# EAGLE design untitled (EAGLE 6.1)
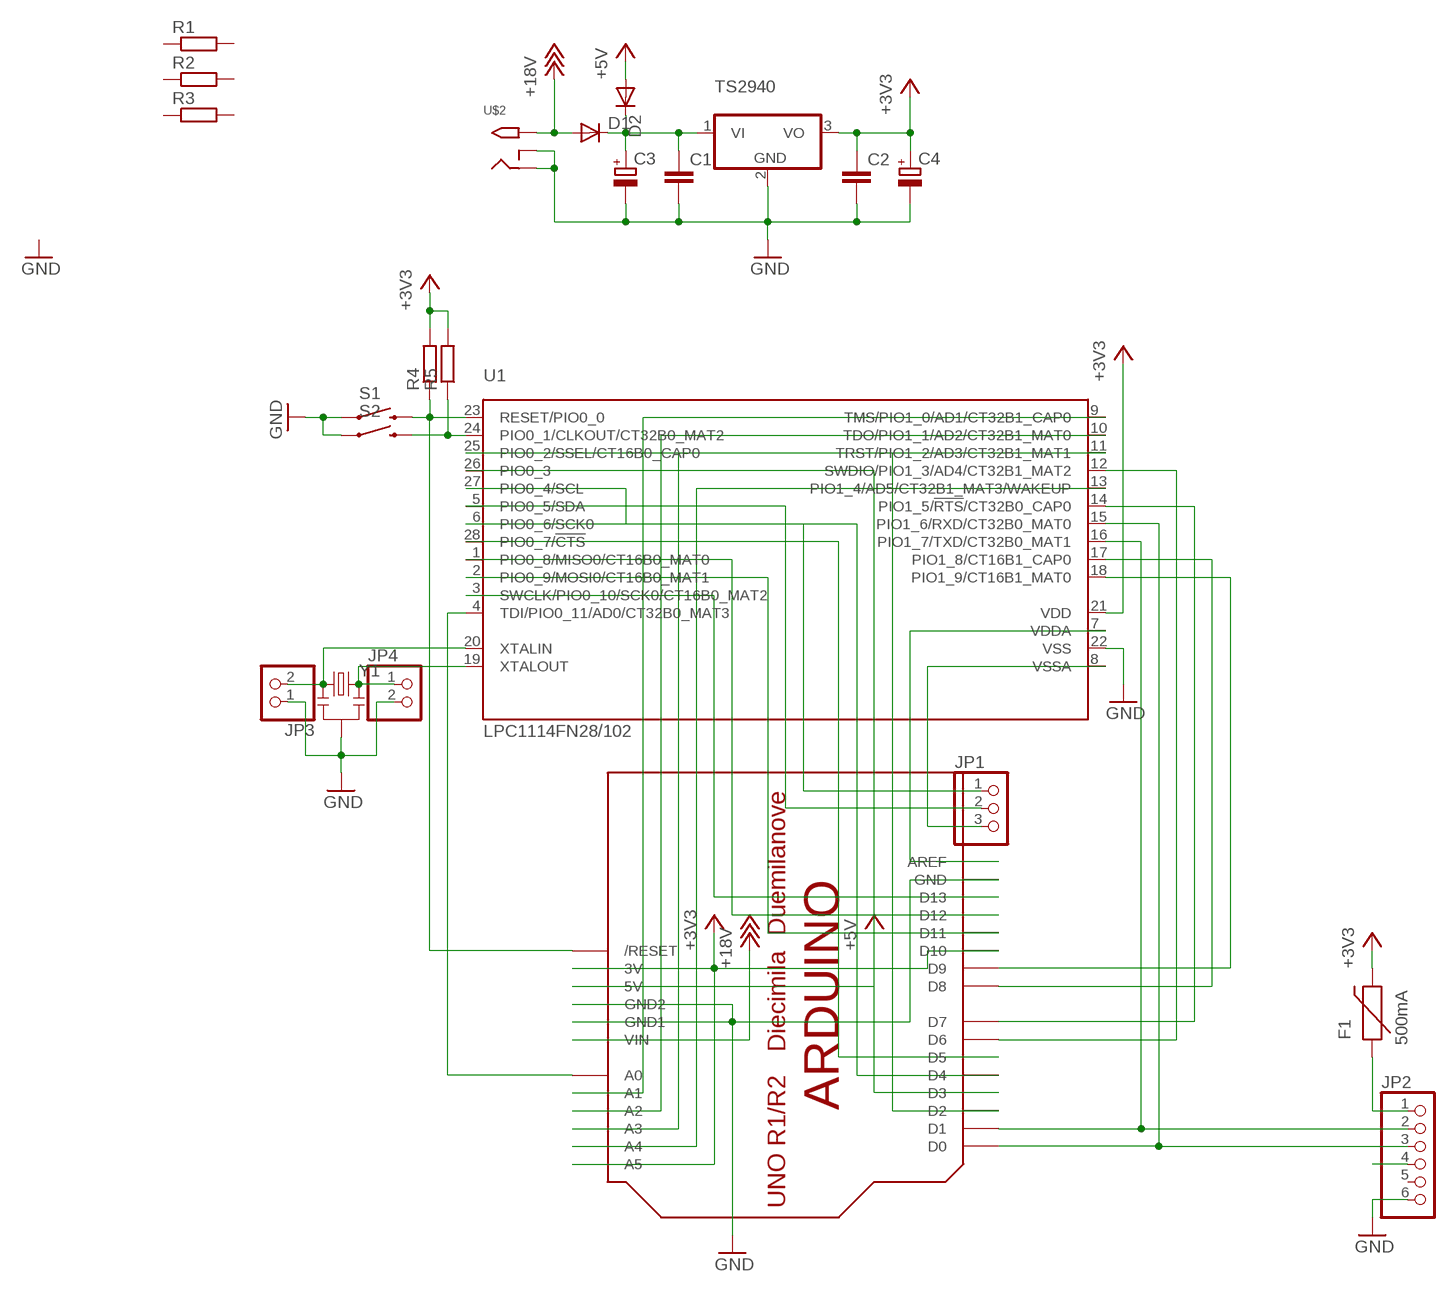
[diagram p0: schematic, sheet 1]

## Parts
C1  C-EU025-025X050  [C025-025X050]
C2  C-EU025-025X050  [C025-025X050]
C3  CPOL-EUE2.5-6  [E2,5-6]
C4  CPOL-EUE2.5-6  [E2,5-6]
D1  DIODE-C1702-05  [C1702-05]
D2  DIODE-C1702-05  [C1702-05]
F1  500mA  PTCPTH  [PTC]
JP1  PINHD-1X3  [1X03]
JP2  PINHD-1X6/90  [1X06/90]
JP3  PINHD-1X2  [1X02]
JP4  PINHD-1X2  [1X02]
R1  R-EU_0204/7  [0204/7]
R2  R-EU_0204/7  [0204/7]
R3  R-EU_0204/7  [0204/7]
R4  R-EU_0204/7  [0204/7]
R5  R-EU_0204/7  [0204/7]
S1  SWITCH-MOMENTARY-2PTH  [TACTILE-PTH]
S2  SWITCH-MOMENTARY-2PTH  [TACTILE-PTH]
TS2940  7805T  [TO220H]
U1  LPC1114FN28/102  [SOT117]
U$1  ARDUINO-BPLACE  [ARDUINO-BPLACE]
U$2  2.1MMJACKTHM  [PJ-102A]
Y1  RESONATORPTH  [RESONATOR-PTH]

## Nets
+3V3: C2.1 C4.+ F1.P$2 R4.2 R5.2 TS2940.3(VO) U1.21(VDD) U$1.3V U$1.A5 U$1.D10
+5V: D2.A U$1.5V
+18V: D1.A U$1.VIN U$2.TIP
GND: C1.2 C2.2 C3.- C4.- JP2.6 JP3.1 JP4.2 S1.1 S2.1 TS2940.2(GND) U1.22(VSS) U$1.GND U$1.GND1 U$1.GND2 U$2.RING U$2.RING_SW Y1.2
N$1: JP2.2 U1.16(PIO1_7/TXD/CT32B0_MAT1) U$1.D1
N$2: U1.4(TDI/PIO0_11/AD0/CT32B0_MAT3) U$1.A0
N$3: U1.9(TMS/PIO1_0/AD1/CT32B1_CAP0) U$1.A1
N$4: U1.10(TDO/PIO1_1/AD2/CT32B1_MAT0) U$1.A2
N$5: U1.11(TRST/PIO1_2/AD3/CT32B1_MAT1) U$1.A3
N$6: U1.13(PIO1_4/AD5/CT32B1_MAT3/WAKEUP) U$1.A4
N$7: C1.1 C3.+ D1.C D2.C TS2940.1(VI)
N$8: R4.1 S1.3 U1.23(RESET/PIO0_0) U$1.RESET(/RESET)
N$9: U1.7(VDDA) U$1.AREF
N$10: JP1.3 U1.8(VSSA)
N$11: JP2.4
N$12: F1.P$1 JP2.1
N$13: U1.3(SWCLK/PIO0_10/SCK0/CT16B0_MAT2) U$1.D13
N$14: U1.2(PIO0_9/MOSI0/CT16B0_MAT1) U$1.D11
N$15: JP2.3 U1.15(PIO1_6/RXD/CT32B0_MAT0) U$1.D0
N$16: U1.1(PIO0_8/MISO0/CT16B0_MAT0) U$1.D12
N$17: JP1.2 U1.5(PIO0_5/SDA)
N$18: JP1.1 U1.27(PIO0_4/SCL)
N$19: R5.1 S2.3 U1.24(PIO0_1/CLKOUT/CT32B0_MAT2)
N$20: JP3.2 U1.20(XTALIN) Y1.1
N$21: JP4.1 U1.19(XTALOUT) Y1.3
N$23: U1.25(PIO0_2/SSEL/CT16B0_CAP0) U$1.D2
N$24: U1.26(PIO0_3) U$1.D3
N$25: U1.6(PIO0_6/SCK0) U$1.D4
N$26: U1.28(PIO0_7/!CTS!) U$1.D5
N$27: U1.12(SWDIO/PIO1_3/AD4/CT32B1_MAT2) U$1.D6
N$28: U1.14(PIO1_5/!RTS!/CT32B0_CAP0) U$1.D7
N$29: U1.17(PIO1_8/CT16B1_CAP0) U$1.D8
N$30: U1.18(PIO1_9/CT16B1_MAT0) U$1.D9
Unconnected: JP2.5 R1.1 R1.2 R2.1 R2.2 R3.1 R3.2

## Library data of the parts
C1 C2 = rcl:C-EU: CAPACITOR, European symbol
C3 C4 = rcl:CPOL-EU: POLARIZED CAPACITOR, European symbol
D1 D2 = diode:DIODE-: DIODE
F1 = SparkFun-PowerIC:PTC: Resettable Fuse PTC Resettable Fuse. Spark Fun Electronics SKU : COM-08357
JP1 = pinhead:PINHD-1X3: PIN HEADER
JP2 = pinhead:PINHD-1X6: PIN HEADER
JP3 JP4 = pinhead:PINHD-1X2: PIN HEADER
R1-R5 = rcl:R-EU_: RESISTOR, European symbol
S1 S2 = SparkFun:SWITCH-MOMENTARY-2
TS2940 = linear:78*: Positive VOLTAGE REGULATOR Source: http://cache.national.com/ds/LM/LM78L05.pdf http://www.fairchildsemi.com/ds/LM/LM7805.pdf
U1 = nxp_60_1_1:LPC1114FN28: 32-bit ARM Cortex-M0 microcontroller; up to 64 kB flash and 8 kB SRAM The LPC1110/11/12/13/14/15 are a ARM Cortex-M0 based, low-cost 32-bit MCU family, designed for 8/16-bit microcontroller applications, offering performance, low power, simple instruction set and memory addressing together with reduced code size compared to existing 8/16-bit architectures. The LPC1110/11/12/13/14/15 operate at CPU frequencies of up to 50 MHz. The peripheral complement of the LPC1110/11/12/13/14/15 includes up to 64 kB of flash memory, up to 8 kB of data memory, one Fast-mode Plus I 2 C-bus interface, one RS-485/EIA-485 UART, up to two SPI interfaces with SSP features, four general purpose counter/timers, a 10-bit ADC, and up to 42 general purpose I/O pins. Remark: The LPC111x series consists of the LPC1100 series (parts LPC111x/101/201/301), LPC1100L series (parts LPC111x/002/102/202/302), and the LPC1100XL series (parts LPC111x/103/203/303/323/333). The LPC1100L and LPC1100XL series include the power profiles, a windowed watchdog timer, and a configurable open-drain mode. AAL Eindhoven MK; ADC: 6; FLASH: 32kB; GPIO: 22; PWR_PROFILES: yes; SERIES: LPC1100L; SPI: 1; SRAM: 4kB
U$1 = adafruit:ARDUINO: Arduino Diecimila/Duemilanove Make a shield with ease, this package has all the named pins as well as the two mounting drill holes and an outline of the USB and DC power connector. The outline is on the DIMENSION layer, so if your board house uses it they will cut the outline to match. http://www.ladyada.net/library/pcb/eaglelibrary.html
U$2 = adafruit:2.1MMJACK: 2.1mm x 5.5mm THM DC jack with internal switch. Digikey part #PJ-102A, 4UCON part #05537 2.1mm x 5.5mm SMT DC jack with internal switch. Digikey part #PJ-002A-SMT, 4UCON part #03267 By microbuilder.eu & adafruit.com
Y1 = SparkFun-FreqCtrl:RESONATOR: Resonator Small SMD resonator. Used, eg, on the Arduino Pro/ Pro Mini boards. 8MHz- XTAL-08895 16MHz- XTAL-08900

## Board
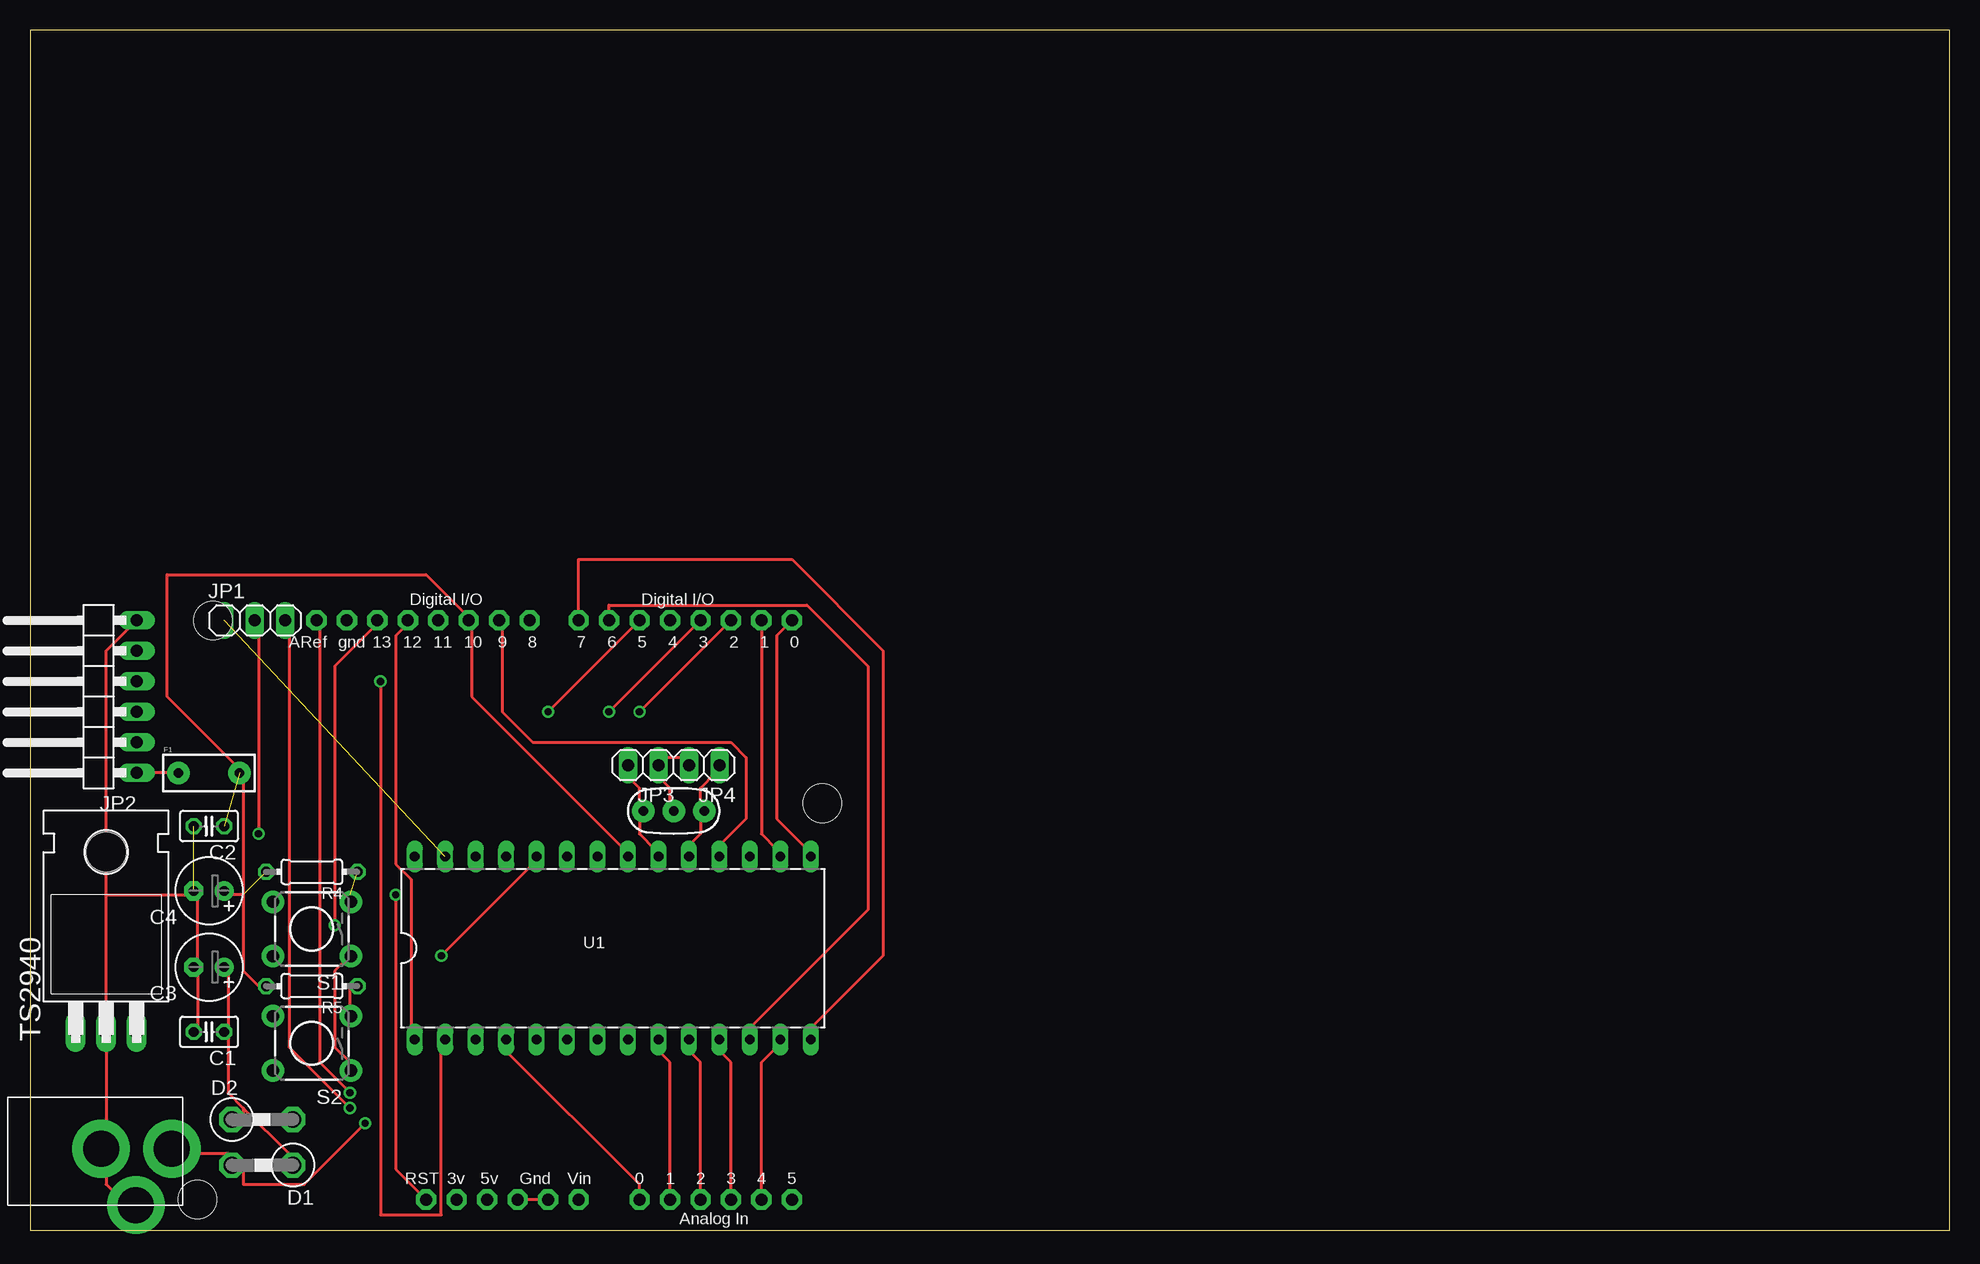
[diagram p1: board, top side]
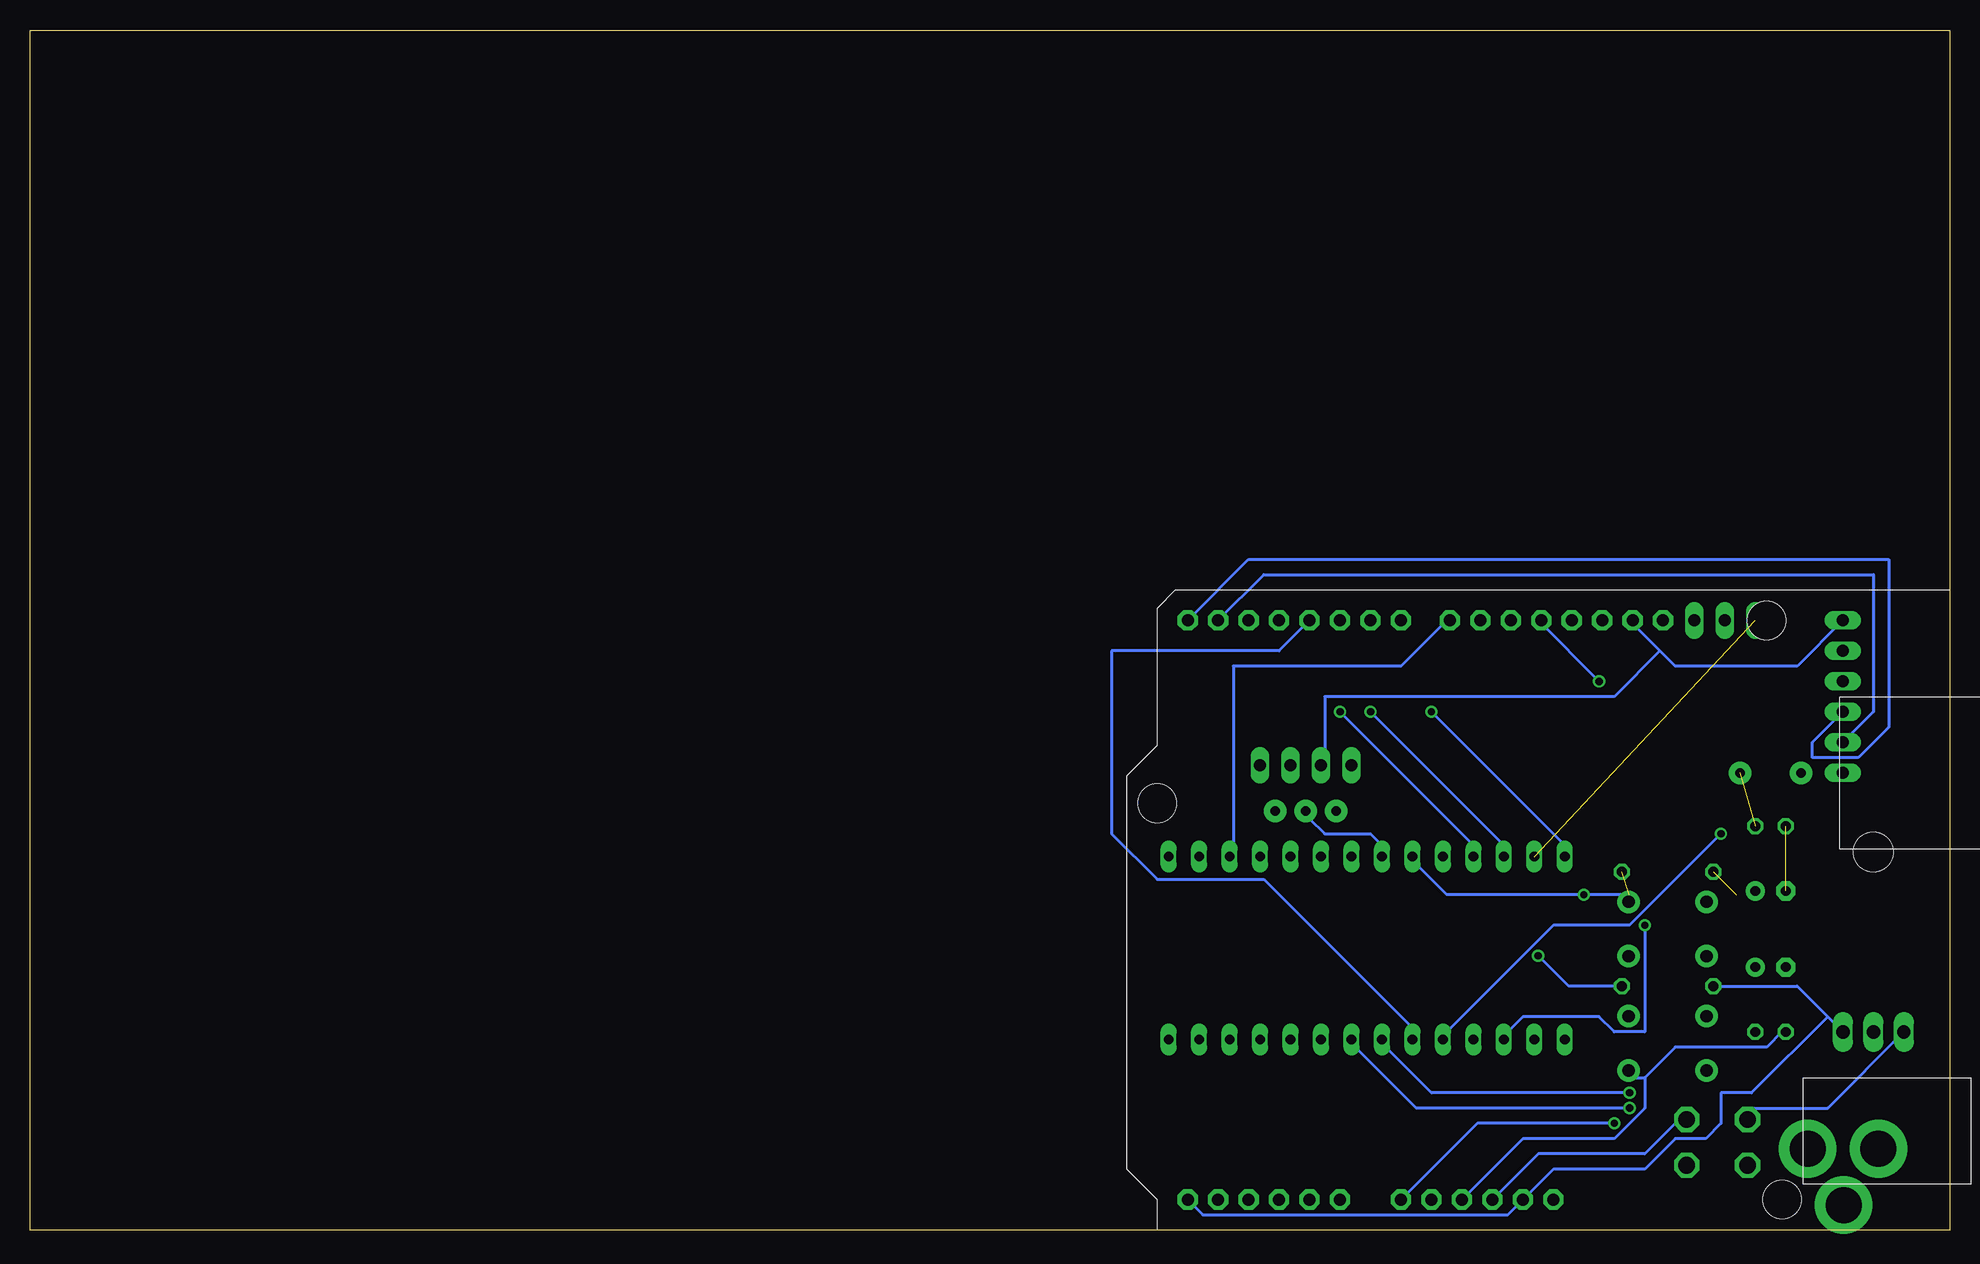
[diagram p2: board, bottom side, seen from below]

Size 160 x 100 mm. Coordinates in mm from the lower left corner, seen from the top.
Outline: 0,0 160,0 160,100 0,100 0,0
Copper layers (1*16): Top 0.035mm / dielectric 1.5mm / Bottom 0.035mm
Design rules: minimum track width 10mil, minimum drill 24mil, track to track 8mil, track to pad 8mil, pad to pad 8mil, via to via 8mil, smd to smd 8mil, copper to edge 40mil, drill to drill 8mil, minimum pad ring 10mil, minimum via ring 8mil, stop-mask expansion 4mil, vias tented up to drill 0mil, thermal gap 10mil

### Footprints (pad centres in the part's own frame; a part is rotated, then mirrored left to right if it is on the bottom)
C025-025X050 = drill 0.813 octagon: 1 -1.27,0; 2 1.27,0
E2,5-6 = drill 0.813 pad 1.6: + -1.27,0 | drill 0.813 pad 1.6 octagon: - 1.27,0
C1702-05 = drill 1.397 octagon: A 2.54,0; C -2.54,0
PTC = drill 0.8 pad 1.88: P$1 -2.54,0; P$2 2.54,0
1X03 = drill 1.016 long: 1 -2.54,0; 2 0,0; 3 2.54,0
1X06/90 = drill 1.016 long: 1 -6.35,-3.81; 2 -3.81,-3.81; 3 -1.27,-3.81; 4 1.27,-3.81; 5 3.81,-3.81; 6 6.35,-3.81
1X02 = drill 1.016 long: 1 -1.27,0; 2 1.27,0
0204/7 = drill 0.813 octagon: 1 -3.81,0; 2 3.81,0
TACTILE-PTH = drill 1.016 pad 1.88: 1 -3.251,2.261; 2 3.251,2.261; 3 -3.251,-2.261; 4 3.251,-2.261
TO220H = drill 1.118 long: 1 -2.54,-10.16; 2 0,-10.16; 3 2.54,-10.16 | hole 3.302: 0,4.826
SOT117 = drill 0.813 long: 1 -16.51,-7.62; 2 -13.97,-7.62; 3 -11.43,-7.62; 4 -8.89,-7.62; 5 -6.35,-7.62; 6 -3.81,-7.62; 7 -1.27,-7.62; 8 1.27,-7.62; 9 3.81,-7.62; 10 6.35,-7.62; 11 8.89,-7.62; 12 11.43,-7.62; 13 13.97,-7.62; 14 16.51,-7.62; 15 16.51,7.62; 16 13.97,7.62; 17 11.43,7.62; 18 8.89,7.62; 19 6.35,7.62; 20 3.81,7.62; 21 1.27,7.62; 22 -1.27,7.62; 23 -3.81,7.62; 24 -6.35,7.62; 25 -8.89,7.62; 26 -11.43,7.62; 27 -13.97,7.62; 28 -16.51,7.62
ARDUINO-BPLACE = drill 1 pad 1.676 octagon: 3V 35.56,2.54; 5V 38.1,2.54; A0 50.8,2.54; A1 53.34,2.54; A2 55.88,2.54; A3 58.42,2.54; A4 60.96,2.54; A5 63.5,2.54; AREF 23.876,50.8; D0 63.5,50.8; D1 60.96,50.8; D2 58.42,50.8; D3 55.88,50.8; D4 53.34,50.8; D5 50.8,50.8; D6 48.26,50.8; D7 45.72,50.8; D8 41.656,50.8; D9 39.116,50.8; D10 36.576,50.8; D11 34.036,50.8; D12 31.496,50.8; D13 28.956,50.8; GND 26.416,50.8; GND1 43.18,2.54; GND2 40.64,2.54; RESET 33.02,2.54; VIN 45.72,2.54 | hole 3.2: 15.24,50.8; 66.04,35.56; 13.97,2.54
PJ-102A = drill 3 pad 4.8: RING 0.1,-3.39; RING_SW -4.6,-6.29; TIP 0.1,-9.29
RESONATOR-PTH = drill 0.8 pad 1.88: 1 -2.54,0; 2 0,0; 3 2.54,0

### Placement (x,y rotation side)
C1  14.92,16.51 180 top
C2  14.92,33.66 180 top
C3  14.92,21.91 180 top
C4  14.92,28.26 180 top
D1  19.37,5.4 180 top
D2  19.37,9.21 0 top
F1  14.92,38.1 0 top
JP1  18.73,50.8 0 top
JP2  5.08,44.45 90 top
JP3  51.12,38.73 180 top
JP4  56.2,38.73 180 top
R1  -46.99,-22.86 0 top  (outside the outline)
R2  -48.26,-19.05 0 top  (outside the outline)
R3  -30.48,-20.32 0 top  (outside the outline)
R4  23.5,29.84 180 top
R5  23.5,20.32 180 top
S1  23.5,25.08 180 top
S2  23.5,15.56 180 top
TS2940  6.35,26.67 0 top
U1  48.58,23.5 0 top
U$1  0,0 0 top
U$2  2.54,6.67 90 top
Y1  53.66,34.92 0 top

### Tracks (layer width: path | path; a pad name or v marks a point on that pad's centre or on a via)
+3V3  (2 unrouted)
  Top 0.254: 36.83,50.8 36.83,44.45 49.53,31.75 U1.21 | 17.78,38.1 17.78,27.94 | 17.78,27.94 17.78,21.59 19.05,20.32 R5.2 | 17.78,27.94 16.51,27.94 C4.+ | 36.83,50.8 33.02,54.61 11.43,54.61 11.43,44.45 17.78,38.1 | 36.83,50.8 U$1.D10 | 17.78,38.1 F1.P$2
  Bottom 0.254: U$1.A5 62.23,1.27 36.83,1.27 U$1.3V 33.02,5.08 25.4,5.08 22.86,7.62 20.32,7.62 19.05,8.89 19.05,11.43 16.51,11.43 10.16,17.78 | 10.16,17.78 12.7,20.32 R5.2 | 10.16,17.78 TS2940.3
+5V
  Bottom 0.254: U$1.5V 34.29,6.35 25.4,6.35 22.86,8.89 D2.A
+18V  (via drill 0.61)
  Top 0.254: v27.94,8.89 22.86,3.81 17.78,3.81 17.78,5.08 D1.A 16.51,6.35 12.7,6.35 U$2.TIP
  Bottom 0.254: U$1.VIN 39.37,8.89 v27.94,8.89
GND  (1 unrouted)
  Top 0.254: U$1.GND1 U$1.GND2 | S2.1 26.67,13.97 25.4,15.24 25.4,21.59 26.67,22.86 S1.1 | U$2.RING_SW 7.62,2.54 6.35,3.81 6.35,6.35 U$2.RING 6.35,7.62 TS2940.2 6.35,27.94 | JP4.2 54.61,39.37 52.07,39.37 JP3.1 52.07,38.1 53.34,36.83 53.34,35.56 Y1.2 | 13.97,21.59 13.97,16.51 C1.2 | 13.97,21.59 13.97,27.94 | 13.97,21.59 C3.- | 26.67,50.8 U$1.GND | JP2.6 6.35,48.26 6.35,27.94 | 6.35,27.94 13.97,27.94 | 13.97,27.94 C4.-
  Bottom 0.254: U$1.GND2 35.56,7.62 27.94,7.62 25.4,10.16 25.4,12.7 | 25.4,12.7 26.67,12.7 S2.1 | U1.22 46.99,31.75 48.26,33.02 52.07,33.02 53.34,34.29 Y1.2 | 24.13,48.26 22.86,46.99 12.7,46.99 JP2.6 | 24.13,48.26 26.67,50.8 U$1.GND | 24.13,48.26 27.94,44.45 52.07,44.45 52.07,39.37 JP3.1 | 25.4,12.7 22.86,15.24 15.24,15.24 13.97,16.51 C1.2
N$1
  Top 0.254: U$1.D1 60.96,33.02 62.23,31.75 U1.16
  Bottom 0.254: JP2.2 6.35,43.18 6.35,54.61 57.15,54.61 U$1.D1
N$2
  Top 0.254: U$1.A0 50.8,3.81 39.37,15.24 U1.4
N$3
  Top 0.254: U$1.A1 53.34,13.97 52.07,15.24 U1.9
N$4
  Top 0.254: U$1.A2 55.88,13.97 54.61,15.24 U1.10
N$5
  Top 0.254: U$1.A3 58.42,13.97 57.15,15.24 U1.11
N$6
  Top 0.254: U$1.A4 60.96,13.97 62.23,15.24 U1.13
N$7
  Top 0.254: 16.51,16.51 16.51,21.59 C3.+ | 17.78,10.16 16.51,11.43 16.51,16.51 | 17.78,10.16 21.59,6.35 D1.C | 16.51,16.51 C1.1 | 17.78,10.16 17.78,8.89 D2.C
  Bottom 0.254: TS2940.1 10.16,10.16 16.51,10.16 D2.C
N$8  (via drill 0.61)  (1 unrouted)
  Top 0.254: U$1.RESET 30.48,5.08 v30.48,27.94
  Bottom 0.254: U1.23 44.45,30.48 41.91,27.94 v30.48,27.94 26.67,27.94 S1.3
N$9  (via drill 0.61)
  Top 0.254: v26.67,11.43 24.13,13.97 24.13,50.8 U$1.AREF
  Bottom 0.254: v26.67,11.43 43.18,11.43 46.99,15.24 U1.7
N$10  (via drill 0.61)
  Top 0.254: v26.67,10.16 21.59,15.24 21.59,50.8 JP1.3
  Bottom 0.254: v26.67,10.16 44.45,10.16 49.53,15.24 U1.8
N$12
  Top 0.254: JP2.1 F1.P$1 12.7,38.1
N$13  (via drill 0.61)
  Top 0.254: v25.4,25.4 25.4,46.99 29.21,50.8 U$1.D13
  Bottom 0.254: v25.4,25.4 25.4,16.51 27.94,16.51 29.21,17.78 35.56,17.78 36.83,16.51 U1.3
N$14  (via drill 0.61)
  Top 0.254: v29.21,45.72 29.21,1.27 34.29,1.27 34.29,15.24 U1.2
  Bottom 0.254: v29.21,45.72 34.29,50.8 U$1.D11
N$15
  Top 0.254: U$1.D0 62.23,49.53 62.23,34.29 64.77,31.75 U1.15
  Bottom 0.254: JP2.3 11.43,40.64 11.43,39.37 7.62,39.37 5.08,41.91 5.08,55.88 58.42,55.88 U$1.D0
N$16
  Top 0.254: U1.1 31.75,16.51 31.75,29.21 30.48,30.48 30.48,49.53 31.75,50.8 U$1.D12
N$17  (via drill 0.61)
  Top 0.254: v19.05,33.02 19.05,50.8 JP1.2
  Bottom 0.254: v19.05,33.02 26.67,25.4 33.02,25.4 41.91,16.51 U1.5
N$18  (1 unrouted)
N$19  (via drill 0.61)
  Top 0.254: R5.1 26.67,20.32 26.67,17.78 S2.3 | v34.29,22.86 41.91,30.48 U1.24
  Bottom 0.254: v34.29,22.86 31.75,20.32 R5.1
N$20
  Top 0.254: U1.20 52.07,31.75 50.8,33.02 50.8,34.29 Y1.1 50.8,35.56 50.8,36.83 49.53,38.1 JP3.2
N$21
  Top 0.254: U1.19 54.61,31.75 55.88,33.02 55.88,34.29 Y1.3 55.88,35.56 55.88,36.83 57.15,38.1 JP4.1
N$23  (via drill 0.61)
  Top 0.254: U$1.D2 v50.8,43.18
  Bottom 0.254: v50.8,43.18 39.37,31.75 U1.25
N$24  (via drill 0.61)
  Top 0.254: U$1.D3 v48.26,43.18
  Bottom 0.254: v48.26,43.18 36.83,31.75 U1.26
N$25
  Bottom 0.254: U$1.D4 55.88,48.26 69.85,48.26 69.85,33.02 66.04,29.21 57.15,29.21 44.45,16.51 U1.6
N$26  (via drill 0.61)
  Top 0.254: U$1.D5 v43.18,43.18
  Bottom 0.254: v43.18,43.18 31.75,31.75 U1.28
N$27
  Top 0.254: U$1.D6 48.26,52.07 64.77,52.07 69.85,46.99 69.85,26.67 59.69,16.51 U1.12
N$28
  Top 0.254: U$1.D7 45.72,55.88 63.5,55.88 71.12,48.26 71.12,22.86 64.77,16.51 U1.14
N$29
  Bottom 0.254: U1.17 59.69,31.75 59.69,46.99 45.72,46.99 41.91,50.8 U$1.D8
N$30
  Top 0.254: U1.18 57.15,31.75 59.69,34.29 59.69,39.37 58.42,40.64 41.91,40.64 39.37,43.18 39.37,50.8 U$1.D9